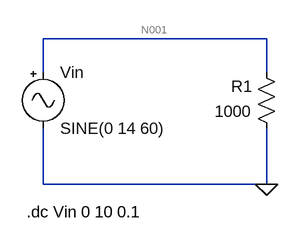
[diagram p0: schematic ELEN 115 Exam 2 #4.asc]
ELEN 115 Exam 2 #4.asc, the LTspice schematic file:
Version 4
SHEET 1 880 680
WIRE 384 64 64 64
WIRE 64 112 64 64
WIRE 384 112 384 64
WIRE 64 272 64 192
WIRE 384 272 384 192
WIRE 384 272 64 272
FLAG 384 272 0
SYMBOL res 400 208 R180
WINDOW 0 36 76 Left 2
WINDOW 3 36 40 Left 2
SYMATTR InstName R1
SYMATTR Value 1000
SYMBOL Misc\\signal 64 96 R0
WINDOW 123 0 0 Left 0
WINDOW 39 0 0 Left 0
SYMATTR InstName Vin
SYMATTR Value SINE(0 14 60)
TEXT 40 312 Left 2 !.dc Vin 0 10 0.1

The netlist it stands for:
* ELEN 115 Exam 2 #4.asc
R1 0 N001 1000
Vin N001 0 SINE(0 14 60)
.dc Vin 0 10 0.1
.backanno
.end

* Results of the author's LTspice run, read from the files saved beside the schematic
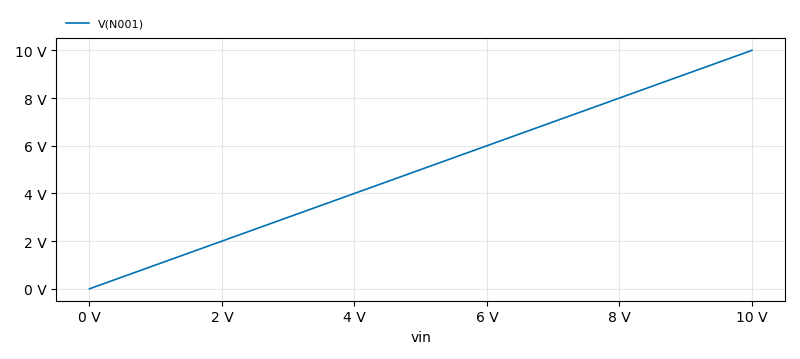
[diagram p1: DC transfer characteristic of ELEN 115 Exam 2 #4.asc, plotted from the saved traces]
* DC transfer characteristic, 1 run:
*   V(N001): 0 V at vin=0 V, 10 V at vin=10 V, min 0 V, max 10 V